# EAGLE design T4p1_thruhole (EAGLE 9.6.2)
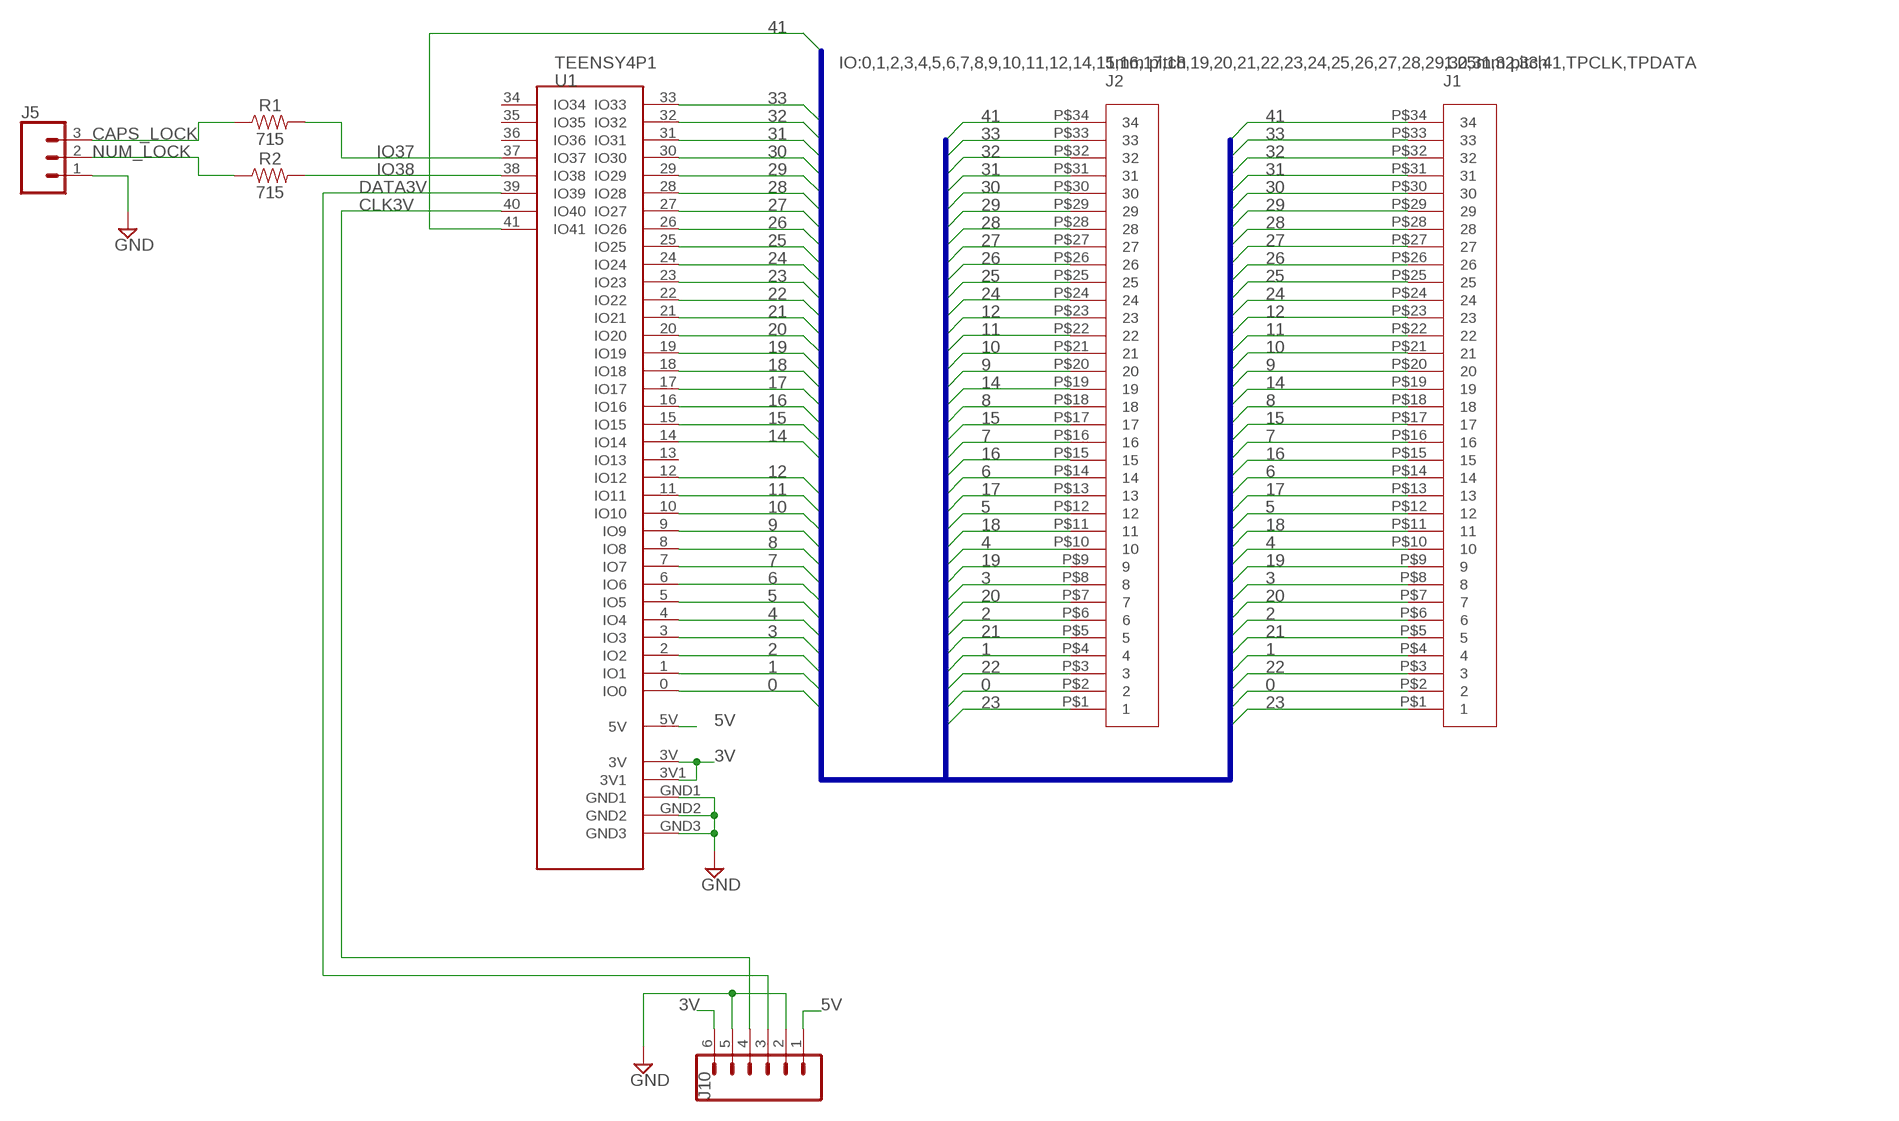
[diagram p0: schematic, sheet 1]

## Parts
J1  1P25MM_THRUHOLE  [1P25MM_THRUHOLE]
J2  1MM_THRUHOLE  [1MM_THRUHOLE]
J5  CONN_031X03_NO_SILK  [1X03_NO_SILK]
J10  CONN_06NO_SILK_NO_POP  [1X06_NO_SILK]
R1  715  RESISTOR_AXIAL  [AXIAL-0.3]
R2  715  RESISTOR_AXIAL  [AXIAL-0.3]
U1  TEENSY4P1  TEENSYP41  [TEENSY4P1]

## Nets
0: J1.P$2 J2.P$2 U1.0(IO0)
1: J1.P$4 J2.P$4 U1.1(IO1)
2: J1.P$6 J2.P$6 U1.2(IO2)
3: J1.P$8 J2.P$8 U1.3(IO3)
3V: J10.6 U1.3V U1.3V1
4: J1.P$10 J2.P$10 U1.4(IO4)
5: J1.P$12 J2.P$12 U1.5(IO5)
5V: J10.1 U1.5V
6: J1.P$14 J2.P$14 U1.6(IO6)
7: J1.P$16 J2.P$16 U1.7(IO7)
8: J1.P$18 J2.P$18 U1.8(IO8)
9: J1.P$20 J2.P$20 U1.9(IO9)
10: J1.P$21 J2.P$21 U1.10(IO10)
11: J1.P$22 J2.P$22 U1.11(IO11)
12: J1.P$23 J2.P$23 U1.12(IO12)
14: J1.P$19 J2.P$19 U1.14(IO14)
15: J1.P$17 J2.P$17 U1.15(IO15)
16: J1.P$15 J2.P$15 U1.16(IO16)
17: J1.P$13 J2.P$13 U1.17(IO17)
18: J1.P$11 J2.P$11 U1.18(IO18)
19: J1.P$9 J2.P$9 U1.19(IO19)
20: J1.P$7 J2.P$7 U1.20(IO20)
21: J1.P$5 J2.P$5 U1.21(IO21)
22: J1.P$3 J2.P$3 U1.22(IO22)
23: J1.P$1 J2.P$1 U1.23(IO23)
24: J1.P$24 J2.P$24 U1.24(IO24)
25: J1.P$25 J2.P$25 U1.25(IO25)
26: J1.P$26 J2.P$26 U1.26(IO26)
27: J1.P$27 J2.P$27 U1.27(IO27)
28: J1.P$28 J2.P$28 U1.28(IO28)
29: J1.P$29 J2.P$29 U1.29(IO29)
30: J1.P$30 J2.P$30 U1.30(IO30)
31: J1.P$31 J2.P$31 U1.31(IO31)
32: J1.P$32 J2.P$32 U1.32(IO32)
33: J1.P$33 J2.P$33 U1.33(IO33)
41: J1.P$34 J2.P$34 U1.41(IO41)
CAPS_LOCK: J5.3 R1.P$1
CLK3V: J10.4 U1.40(IO40)
DATA3V: J10.3 U1.39(IO39)
GND: J5.1 J10.2 J10.5 U1.GND1 U1.GND2 U1.GND3
IO37: R1.P$2 U1.37(IO37)
IO38: R2.P$2 U1.38(IO38)
NUM_LOCK: J5.2 R2.P$1
Unconnected: U1.13(IO13) U1.34(IO34) U1.35(IO35) U1.36(IO36)

## Buses
IO:0,1,2,3,4,5,6,7,8,9,10,11,12,14,15,16,17,18,19,20,21,22,23,24,25,26,27,28,29,30,31,32,33,41,TPCLK,TPDATA

## Notes on the sheet
- 1mm pitch | 1.25mm pitch

## Library data of the parts
J1 = 1P25MM_THRUHOLE:1P25MM_THRUHOLE
J2 = 1MM_THRUHOLE:1MM_THRUHOLE
J5 = SparkFun-Connectors:CONN_03: Multi connection point. Often used as Generic Header-pin footprint for 0.1 inch spaced/style header connections On any of the 0.1 inch spaced packages, you can populate with these: Break Away Headers - Straight <https://www.sparkfun.com/products/116> (PRT-00116) Break Away Male Headers - Right Angle <https://www.sparkfun.com/products/553> (PRT-00553) Female Headers <https://www.sparkfun.com/products/115> (PRT-00115) Break Away Headers - Machine Pin <https://www.sparkfun.com/products/117> (PRT-00117) Break Away Female Headers - Swiss Machine Pin <https://www.sparkfun.com/products/743> (PRT-00743) Stackable Header - 3 Pin (Female, 0.1") <https://www.sparkfun.com/products/13875> (PRT-13875) For SCREWTERMINALS and SPRING TERMINALS visit here: Screw Terimnals on SparkFun.com <https://www.sparkfun.com/search/results?term=Screw+Terminals> (5mm/3.5mm/2.54mm spacing) This device is also useful as a general connection point to wire up your design to another part of your project. Our various solder wires solder well into these plated through hole pads. Hook-Up Wire - Assortment (Stranded, 22 AWG) <https://www.sparkfun.com/products/11375> (PRT-11375) Hook-Up Wire - Assortment (Solid Core, 22 AWG) <https://www.sparkfun.com/products/11367> (PRT-11367) View the entire wire category on our website here <https://www.sparkfun.com/categories/141> Special notes: Molex polarized connector foot print use with SKU : PRT-08232 with associated crimp pins and housings.
J10 = SparkFun-Connectors:CONN_06: Multi connection point. Often used as Generic Header-pin footprint for 0.1 inch spaced/style header connections On any of the 0.1 inch spaced packages, you can populate with these: Break Away Headers - Straight <https://www.sparkfun.com/products/116> (PRT-00116) Break Away Male Headers - Right Angle <https://www.sparkfun.com/products/553> (PRT-00553) Female Headers <https://www.sparkfun.com/products/115> (PRT-00115) Break Away Headers - Machine Pin <https://www.sparkfun.com/products/117> (PRT-00117) Break Away Female Headers - Swiss Machine Pin <https://www.sparkfun.com/products/743> (PRT-00743) Arduino Stackable Header - 6 Pin <https://www.sparkfun.com/products/9280> (PRT-09280) For SCREWTERMINALS and SPRING TERMINALS visit here: Screw Terimnals on SparkFun.com <https://www.sparkfun.com/search/results?term=Screw+Terminals> (5mm/3.5mm/2.54mm spacing) This device is also useful as a general connection point to wire up your design to another part of your project. Our various solder wires solder well into these plated through hole pads. Hook-Up Wire - Assortment (Stranded, 22 AWG) <https://www.sparkfun.com/products/11375> (PRT-11375) Hook-Up Wire - Assortment (Solid Core, 22 AWG) <https://www.sparkfun.com/products/11367> (PRT-11367) View the entire wire category on our website here <https://www.sparkfun.com/categories/141>
R1 R2 = Resistor_Axial:RESISTOR_AXIAL
U1 = TEENSY4P1:TEENSYP41

## Board
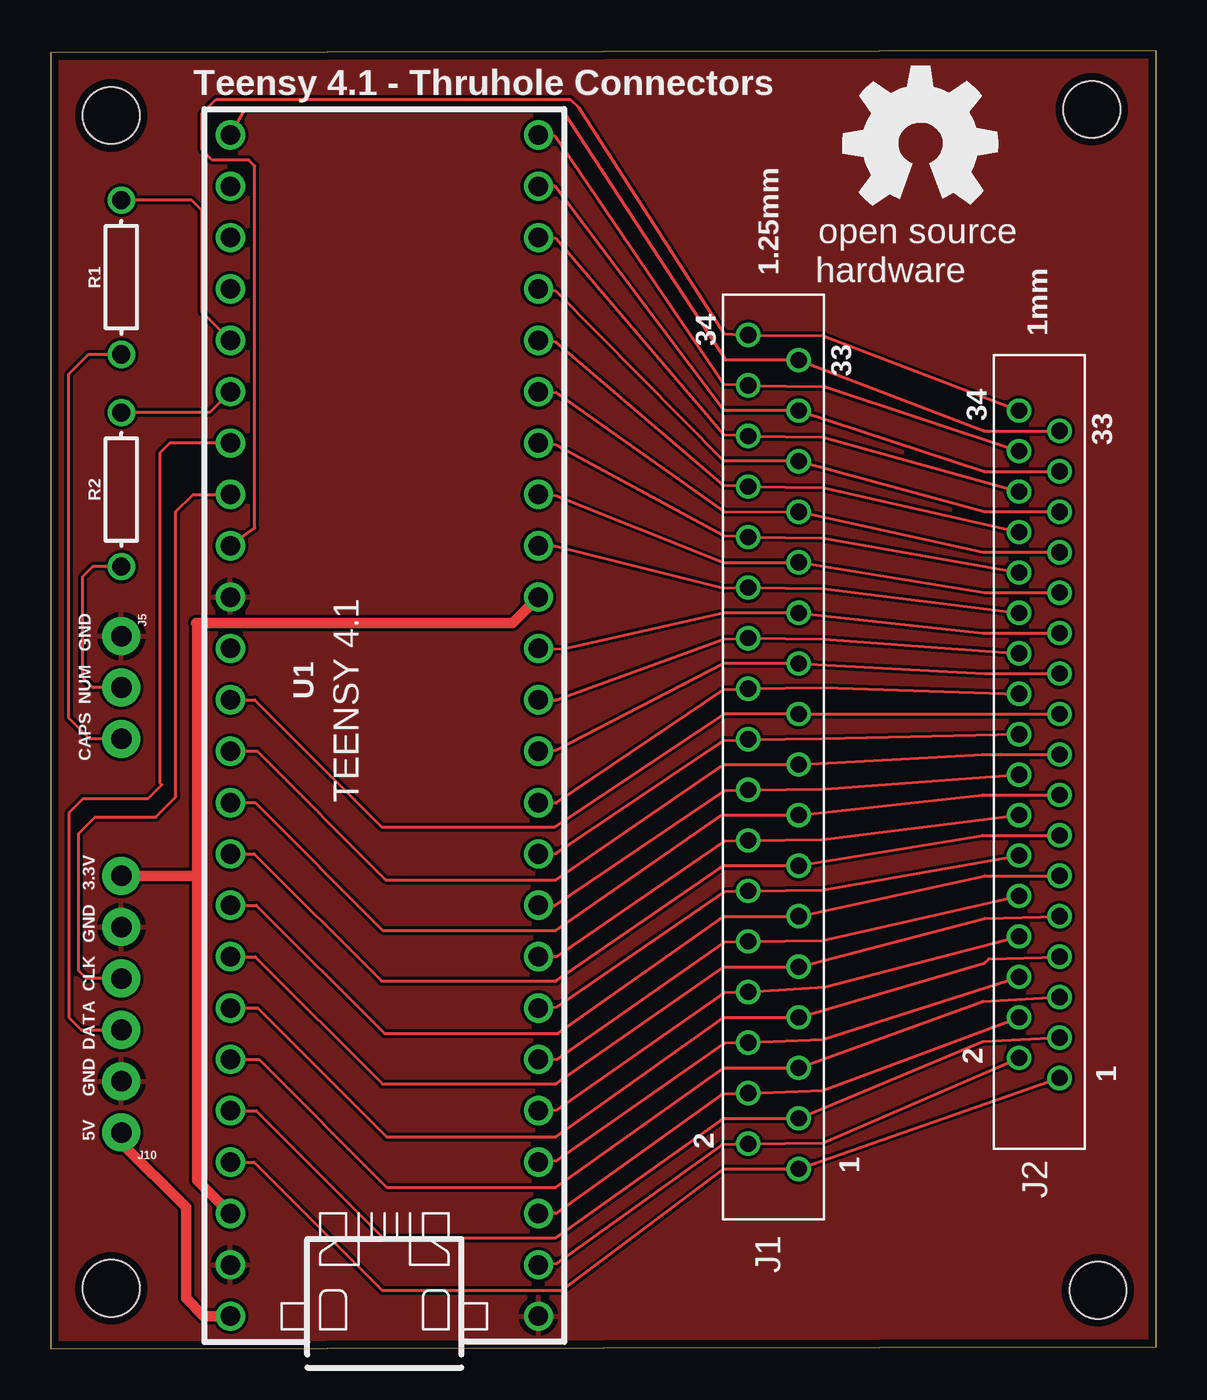
[diagram p1: board, top side]
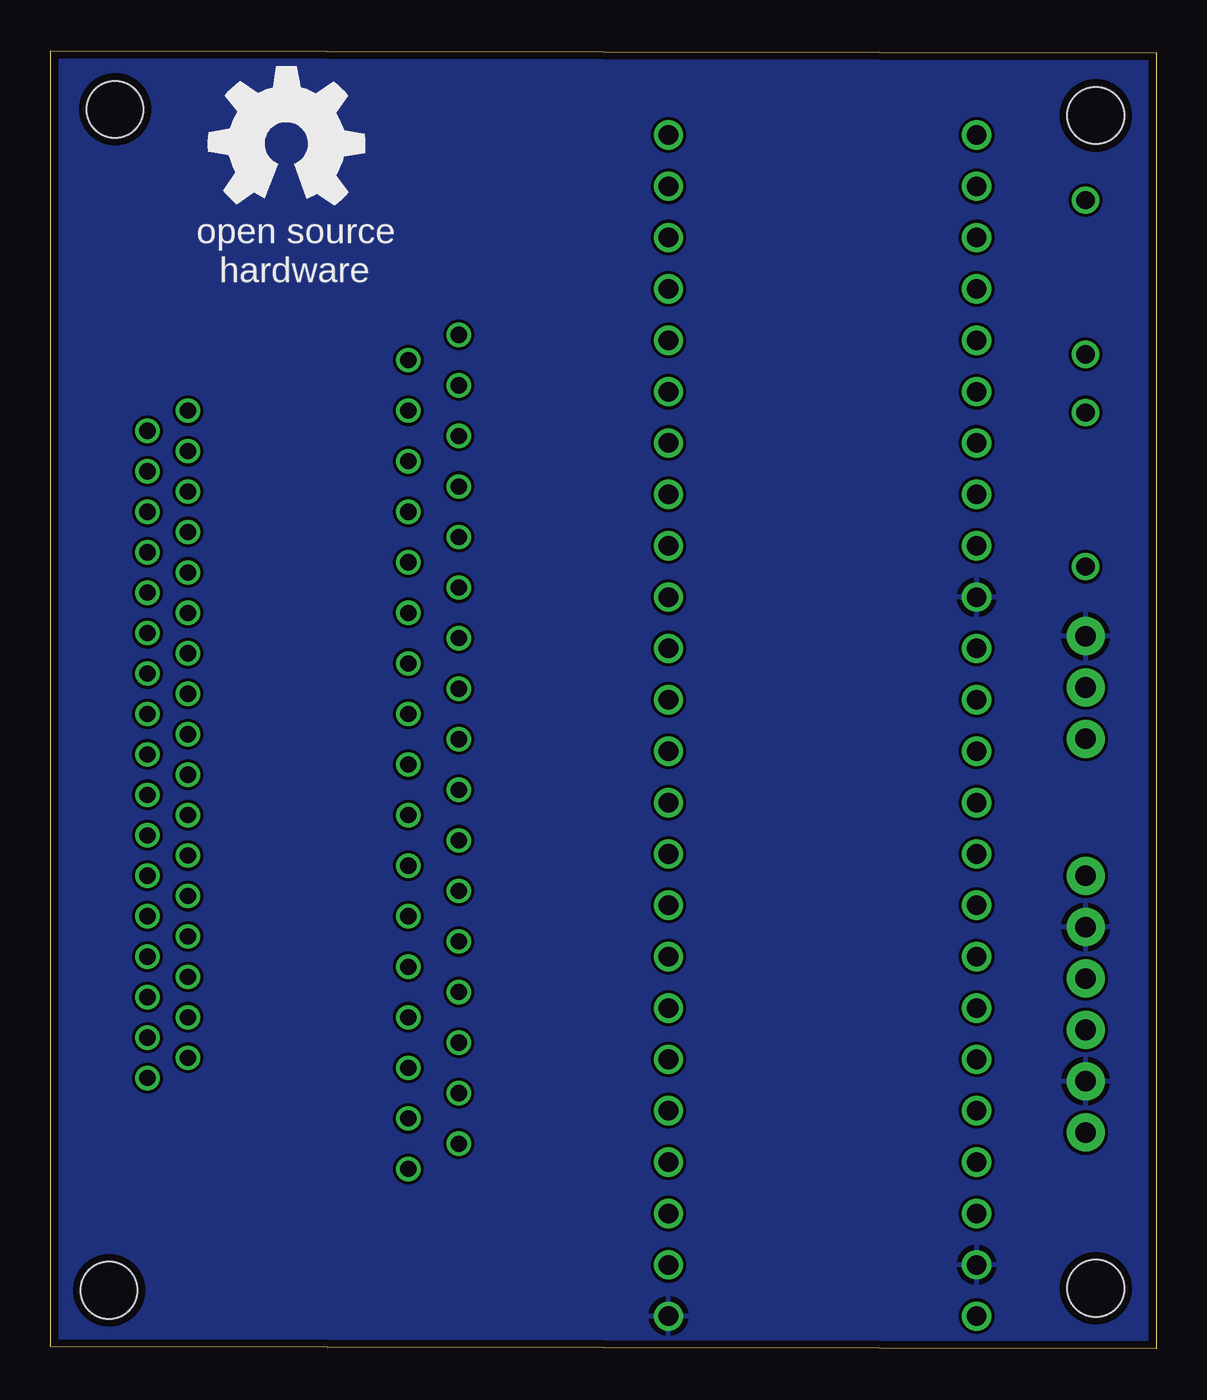
[diagram p2: board, bottom side, seen from below]

Size 54.69 x 64.21 mm. Coordinates in mm from the lower left corner, seen from the top.
Outline: 0,0 54.69,0.1 54.69,64.21 0,64.11 0,0
Copper layers (1*16): Top 0.035559375mm / dielectric 1.6mm / Bottom 0.035559375mm
Design rules "oshpark-2layer": minimum track width 6mil, minimum drill 10mil, track to track 6mil, track to pad 6mil, pad to pad 6mil, via to via 6mil, smd to smd 6mil, copper to edge 15mil, drill to drill 6mil, minimum pad ring 5mil, minimum via ring 5mil, stop-mask expansion 2.5mil, vias tented up to drill 0mil, thermal gap 10mil
Holes 2.8 mm at 3,3 51.8,2.9 51.5,61.3 3,61

### Footprints (pad centres in the part's own frame; a part is rotated, then mirrored left to right if it is on the bottom)
1P25MM_THRUHOLE = drill 0.8: P$1 0,0; P$2 1.25,2.5; P$3 2.5,0; P$4 3.75,2.5; P$5 5,0; P$6 6.25,2.5; P$7 7.5,0; P$8 8.75,2.5; P$9 10,0; P$10 11.25,2.5; P$11 12.5,0; P$12 13.75,2.5; P$13 15,0; P$14 16.25,2.5; P$15 17.5,0; P$16 18.75,2.5; P$17 20,0; P$18 21.25,2.5; P$19 22.5,0; P$20 23.75,2.5; P$21 25,0; P$22 26.25,2.5; P$23 27.5,0; P$24 28.75,2.5; P$25 30,0; P$26 31.25,2.5; P$27 32.5,0; P$28 33.75,2.5; P$29 35,0; P$30 36.25,2.5; P$31 37.5,0; P$32 38.75,2.5; P$33 40,0; P$34 41.25,2.5
1MM_THRUHOLE = drill 0.8: P$1 0,0; P$2 1,2; P$3 2,0; P$4 3,2; P$5 4,0; P$6 5,2; P$7 6,0; P$8 7,2; P$9 8,0; P$10 9,2; P$11 10,0; P$12 11,2; P$13 12,0; P$14 13,2; P$15 14,0; P$16 15,2; P$17 16,0; P$18 17,2; P$19 18,0; P$20 19,2; P$21 20,0; P$22 21,2; P$23 22,0; P$24 23,2; P$25 24,0; P$26 25,2; P$27 26,0; P$28 27,2; P$29 28,0; P$30 29,2; P$31 30,0; P$32 31,2; P$33 32,0; P$34 33,2
1X03_NO_SILK = drill 1.016 pad 1.88: 1 0,0; 2 2.54,0; 3 5.08,0
1X06_NO_SILK = drill 1.016 pad 1.88: 1 0,0; 2 2.54,0; 3 5.08,0; 4 7.62,0; 5 10.16,0; 6 12.7,0
AXIAL-0.3 = drill 0.9: P$1 -3.81,0; P$2 3.81,0
TEENSY4P1 = drill 0.965: 0 -26.67,-6.35; 1 -24.13,-6.35; 2 -21.59,-6.35; 3 -19.05,-6.35; 3V -24.13,8.89; 3V1 6.35,-6.35; 4 -16.51,-6.35; 5 -13.97,-6.35; 5V -29.21,8.89; 6 -11.43,-6.35; 7 -8.89,-6.35; 8 -6.35,-6.35; 9 -3.81,-6.35; 10 -1.27,-6.35; 11 1.27,-6.35; 12 3.81,-6.35; 13 3.81,8.89; 14 1.27,8.89; 15 -1.27,8.89; 16 -3.81,8.89; 17 -6.35,8.89; 18 -8.89,8.89; 19 -11.43,8.89; 20 -13.97,8.89; 21 -16.51,8.89; 22 -19.05,8.89; 23 -21.59,8.89; 24 8.89,-6.35; 25 11.43,-6.35; 26 13.97,-6.35; 27 16.51,-6.35; 28 19.05,-6.35; 29 21.59,-6.35; 30 24.13,-6.35; 31 26.67,-6.35; 32 29.21,-6.35; 33 29.21,8.89; 34 26.67,8.89; 35 24.13,8.89; 36 21.59,8.89; 37 19.05,8.89; 38 16.51,8.89; 39 13.97,8.89; 40 11.43,8.89; 41 8.89,8.89; GND1 -29.21,-6.35; GND2 -26.67,8.89; GND3 6.35,8.89

### Placement (x,y rotation side)
J1  37,8.9 90 top
J2  49.9,13.4 90 top
J5  3.5,35.25 270 top
J10  3.5,10.7 90 top
R1  3.5,53 90 top
R2  3.5,42.5 90 top
U1  17.78,30.83 90 top
U$1  [OSHW_8MM]  43,59.6 0 top
U$2  [OSHW_8MM]  43,59.6 0 top

### Tracks (layer width: path | path; a pad name or v marks a point on that pad's centre or on a via)
0
  Top 0.152: U1.0 25,4.2 33.2,10.1 J1.P$2 38.2,10.2 J2.P$2
1
  Top 0.152: U1.1 25,6.7 33.2,12.6 J1.P$4 38.2,12.8 J2.P$4
2
  Top 0.152: U1.2 25,9.3 33.3,15.1 J1.P$6 38.2,15.3 J2.P$6
3
  Top 0.152: U1.3 25,11.8 33.3,17.6 J1.P$8 38.3,17.9 J2.P$8
3V
  Top 0.254: 7.24,35.86 7.21,35.89
  Top 0.508: U1.3V1 22.84,35.89 7.21,35.89 | U1.3V 7.24,8.35 7.24,23.4 | 7.24,23.4 7.24,35.86 | J10.6 7.24,23.4
4
  Top 0.152: U1.4 25,14.3 33.3,20.1 J1.P$10 38.2,20.2 J2.P$10
5
  Top 0.152: U1.5 25,16.9 33.3,22.6 J1.P$12 38.2,22.7 J2.P$12
5V
  Top 0.508: U1.5V 7.58,1.62 6.7,2.5 6.7,7 3.5,10.2 J10.1
6
  Top 0.152: U1.6 25,19.4 33.3,25.1 J1.P$14 38.2,25.2 J2.P$14
7
  Top 0.152: U1.7 24.9,21.9 33.3,27.6 J1.P$16 38.3,27.7 J2.P$16
8
  Top 0.152: U1.8 25,24.5 33.3,30.1 J1.P$18 38.2,30.2 J2.P$18
9
  Top 0.152: U1.9 25,27 33.3,32.6 J1.P$20 38.2,32.7 J2.P$20
10
  Top 0.152: U1.10 25,29.6 33.3,33.9 J1.P$21 46.2,33.4 J2.P$21
11
  Top 0.152: U1.11 25,32.1 33.3,35.1 J1.P$22 38.2,35.1 J2.P$22
12
  Top 0.152: J2.P$23 46.1,35.4 J1.P$23 33.3,36.4 25.3,34.6 U1.12
14
  Top 0.152: U1.14 10.1,32.1 16.4,25.8 24.9,25.8 33.3,31.4 J1.P$19 J2.P$19
15
  Top 0.152: U1.15 10.22,29.56 16.58,23.2 25,23.2 33.3,28.9 37.09,28.91 | J1.P$17 37.09,28.91 | 37.09,28.91 46.1,29.4 J2.P$17
16
  Top 0.152: U1.16 10.11,27.02 16.43,20.7 25,20.7 33.2,26.4 37.09,26.41 | J1.P$15 37.09,26.41 | 37.09,26.41 46.1,27.4 J2.P$15
17
  Top 0.152: U1.17 10.08,24.48 16.36,18.2 25,18.2 33.3,23.9 J1.P$13 46.1,25.4 J2.P$13
18
  Top 0.152: U1.18 10.18,21.94 16.52,15.6 25.1,15.6 33.3,21.4 J1.P$11 46.2,23.4 J2.P$11
19
  Top 0.152: U1.19 10.12,19.4 16.42,13.1 25,13.1 33.3,18.9 J1.P$9 46.2,21.3 J2.P$9
20
  Top 0.152: U1.20 10.25,16.86 16.61,10.5 25,10.5 33.3,16.4 J1.P$7 46.2,19.1 46.4,19.3 J2.P$7
21
  Top 0.152: U1.21 10.31,14.32 16.63,8 25,8 33.3,13.9 J1.P$5 46.1,17.2 J2.P$5
22
  Top 0.152: U1.22 10.17,11.78 16.45,5.5 25,5.5 33.3,11.4 J1.P$3 46.1,15.2 J2.P$3
23
  Top 0.152: U1.23 10.06,9.24 16.4,2.9 25.3,2.9 33.3,8.9 J1.P$1 J2.P$1
24
  Top 0.152: U1.24 24.9,39.7 33.3,37.6 J1.P$24 38.2,37.6 J2.P$24
25
  Top 0.152: U1.25 25,42.2 33.3,38.9 37.11,38.88 | J1.P$25 37.11,38.88 | 37.11,38.88 46.2,37.4 J2.P$25
26
  Top 0.152: U1.26 25,44.7 33.3,40.2 J1.P$26 38.2,40.1 J2.P$26
27
  Top 0.152: U1.27 25,47.3 33.3,41.4 37.12,41.37 | J1.P$27 37.12,41.37 | 37.12,41.37 46.1,39.4 J2.P$27
28
  Top 0.152: U1.28 25,49.8 33.3,42.7 J1.P$28 38.2,42.6 J2.P$28
29
  Top 0.152: U1.29 25,52.3 33.3,43.9 J1.P$29 46.2,41.4 J2.P$29
30
  Top 0.152: U1.30 25,54.9 33.3,45.2 J1.P$30 38.2,45.1 J2.P$30
31
  Top 0.152: U1.31 24.94,57.5 33.3,46.4 J1.P$31 46.2,43.4 J2.P$31
32
  Top 0.152: U1.32 24.95,59.97 33.3,47.7 J1.P$32 38.3,47.6 J2.P$32
33
  Top 0.152: J2.P$33 46.2,45.4 J1.P$33 33.4,48.9 25.3,61.3 9.6,61.3 U1.33
41
  Top 0.152: J1.P$34 34.6,50.15 | 34.6,50.15 38.2,50.1 J2.P$34 | U1.41 10.1,40.6 10.1,58.5 9.8,58.8 8,58.8 7.5,59.3 7.5,61.1 8.2,61.8 25.7,61.8 26.1,61.4 33.3,50.2 34.6,50.15
CAPS_LOCK
  Top 0.152: J5.3 1.93,30.17 0.9,31.2 0.9,48.2 1.89,49.19 R1.P$1
CLK3V
  Top 0.152: J10.4 1.78,18.32 1.4,18.7 1.4,25.5 2.2,26.3 5.2,26.3 6.2,27.3 6.2,41.4 7.06,42.26 U1.40
DATA3V
  Top 0.152: U1.39 5.9,44.8 5.4,44.3 5.4,28 5.5,27.9 4.8,27.2 1.6,27.2 0.9,26.5 0.9,16.4 1.52,15.78 J10.3
GND
  pour Top: -0.01,0 -0.01,64.09 54.88,64.09 54.88,0
  pour Bottom: 0,0 0,64.1 54.7,64.1 54.7,0
IO37
  Top 0.152: U1.37 7.5,51.27 7.5,56.3 6.99,56.81 R1.P$2
IO38
  Top 0.152: U1.38 7.86,46.31 R2.P$2
NUM_LOCK
  Top 0.152: J5.2 2.09,32.71 1.6,33.2 1.6,38.2 2.09,38.69 R2.P$1

### Text on the board
tPlace: Teensy 4.1 - Thruhole Connectors | 1.25mm | 34 | 1mm | 33 | 34 | 33 | GND | NUM | U1 | CAPS | 3.3V | GND | CLK | DATA | 2 | 1 | GND | 5V | 2 | 1